# EAGLE design Breadproto (EAGLE 7.6.0)
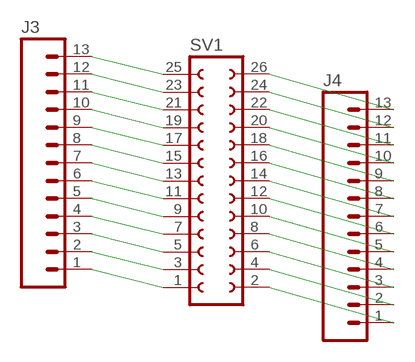
[diagram p0: schematic, sheet 1]

## Parts
J3  M13  [1X13]
J4  M13  [1X13]
SV1  FE13-2  [FE13-2]

## Nets
N$1: J3.1 SV1.1
N$2: J3.2 SV1.3
N$3: J3.3 SV1.5
N$4: J3.4 SV1.7
N$5: J3.5 SV1.9
N$6: J3.6 SV1.11
N$7: J3.7 SV1.13
N$8: J3.8 SV1.15
N$9: J3.9 SV1.17
N$10: J3.10 SV1.19
N$11: J3.11 SV1.21
N$12: J3.12 SV1.23
N$13: J3.13 SV1.25
N$14: J4.1 SV1.2
N$15: J4.2 SV1.4
N$16: J4.3 SV1.6
N$17: J4.4 SV1.8
N$18: J4.5 SV1.10
N$19: J4.6 SV1.12
N$20: J4.7 SV1.14
N$21: J4.8 SV1.16
N$22: J4.9 SV1.18
N$23: J4.10 SV1.20
N$24: J4.11 SV1.22
N$25: J4.12 SV1.24
N$26: J4.13 SV1.26

## Library data of the parts
J3 J4 = SparkFun-Connectors:M13: 13-pin single row .1" header
SV1 = con-lsta:FE13-2: FEMALE HEADER; OC_FARNELL: unknown; OC_NEWARK: unknown

## Board
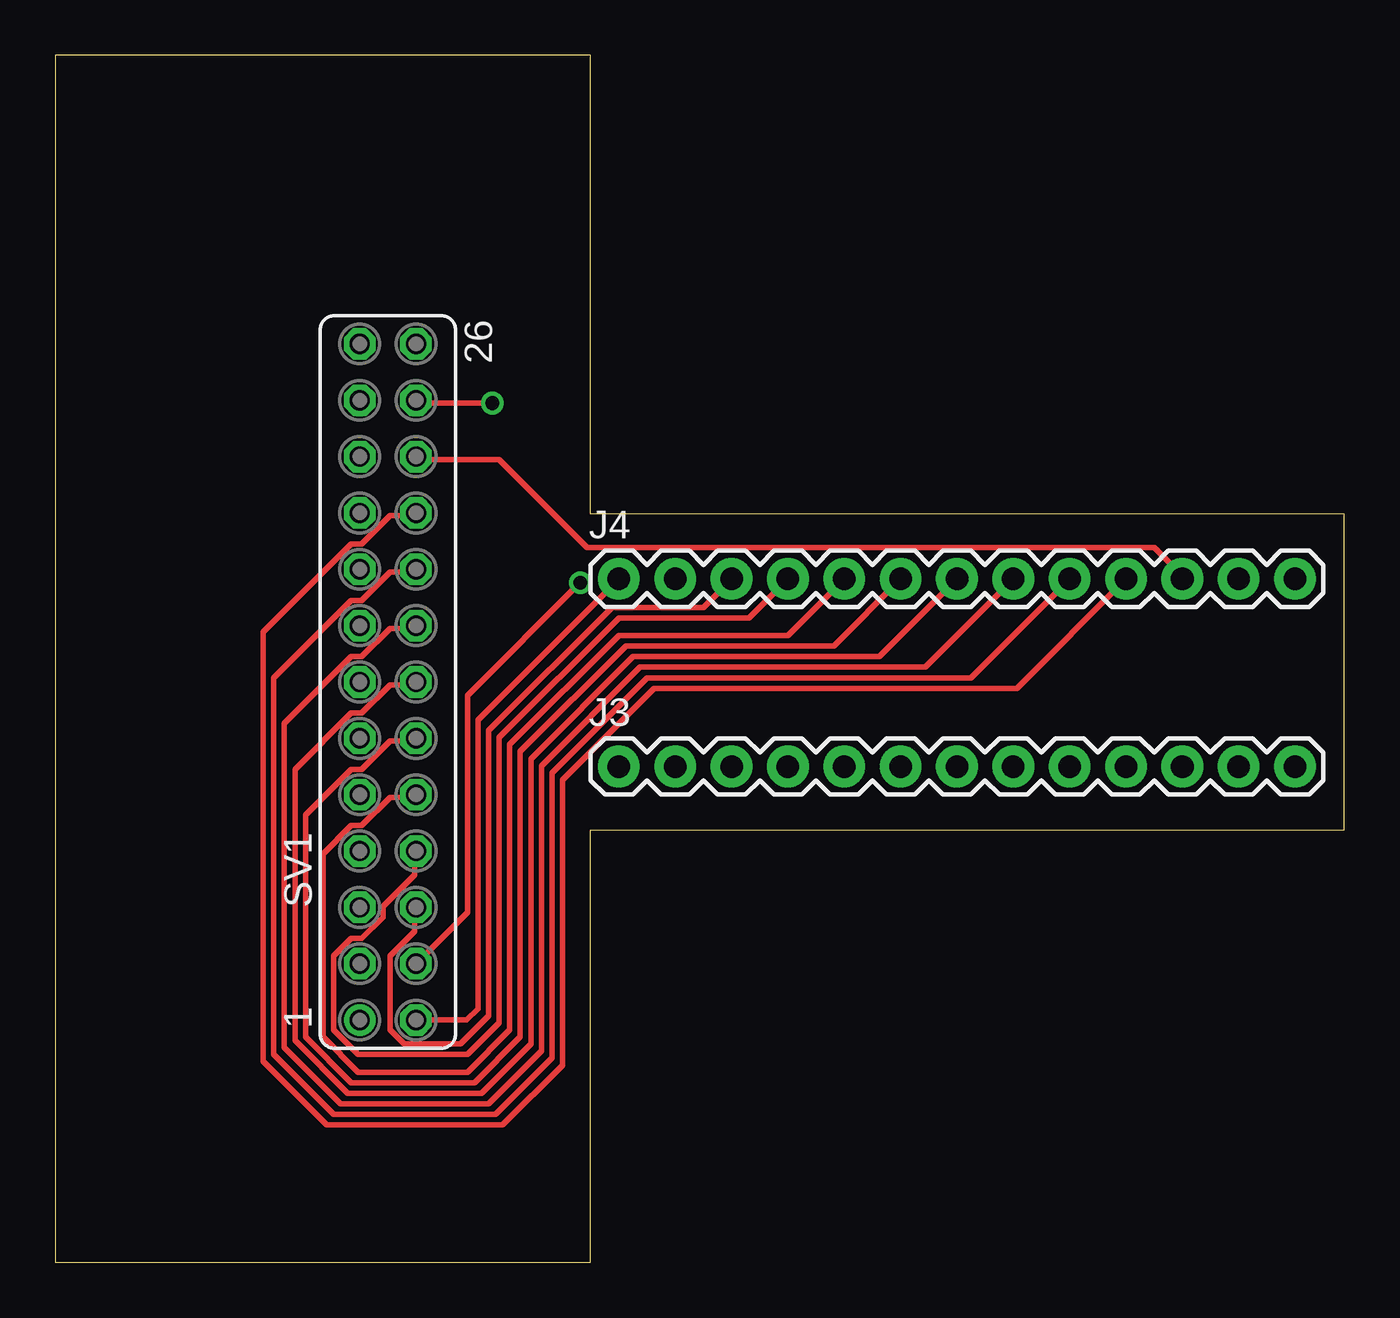
[diagram p1: board, top side]
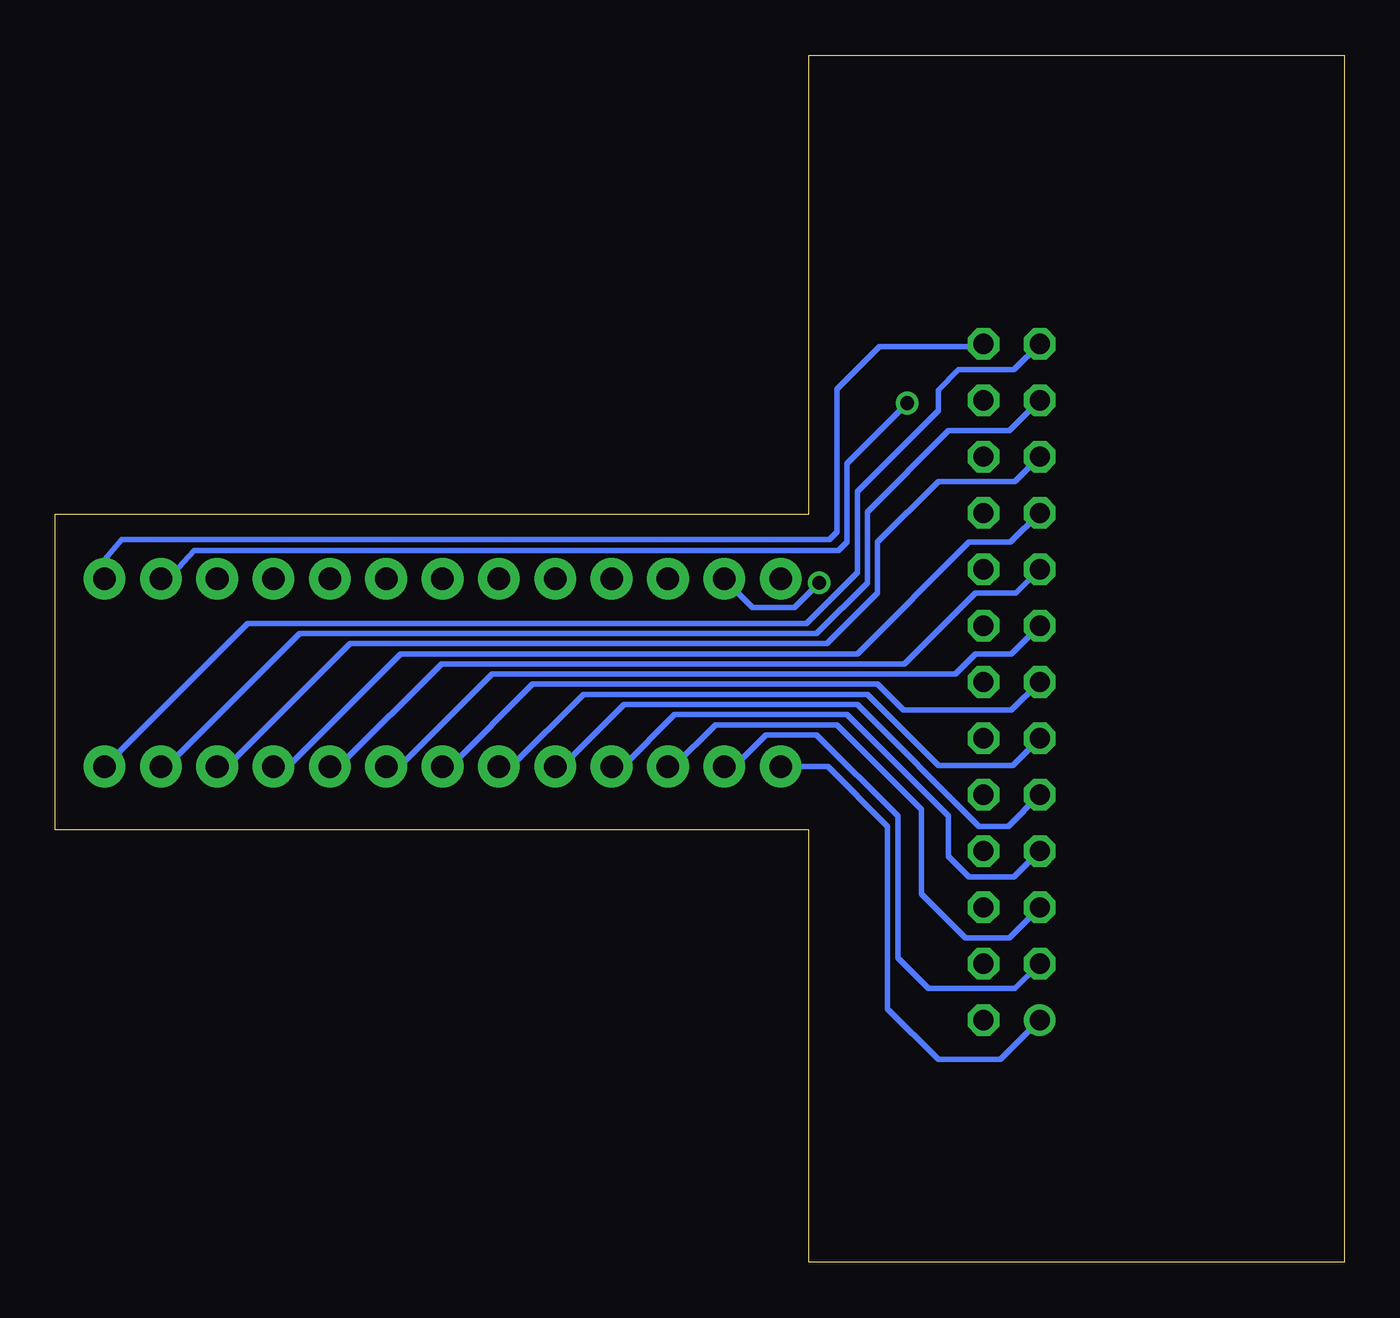
[diagram p2: board, bottom side, seen from below]

Size 58.09 x 54.41 mm. Coordinates in mm from the lower left corner, seen from the top.
Outline: 0,0 24.13,0 24.13,19.48 58.09,19.48 58.09,33.73 24.13,33.73 24.13,54.41 0,54.41 0,0
Copper layers (1*16): Top 0.035mm / dielectric 1.5mm / Bottom 0.035mm
Design rules "default": minimum track width 10mil, minimum drill 24mil, track to track 8mil, track to pad 8mil, pad to pad 8mil, via to via 8mil, smd to smd 8mil, copper to edge 40mil, drill to drill 8mil, minimum pad ring 10mil, minimum via ring 8mil, stop-mask expansion 4mil, vias tented up to drill 0mil, thermal gap 10mil

### Footprints (pad centres in the part's own frame; a part is rotated, then mirrored left to right if it is on the bottom)
1X13 = drill 1.016 pad 1.88: 1 0,0; 2 2.54,0; 3 5.08,0; 4 7.62,0; 5 10.16,0; 6 12.7,0; 7 15.24,0; 8 17.78,0; 9 20.32,0; 10 22.86,0; 11 25.4,0; 12 27.94,0; 13 30.48,0
FE13-2 = drill 0.914: 1 -15.24,1.27 | drill 0.914 octagon: 2 -15.24,-1.27; 3 -12.7,1.27; 4 -12.7,-1.27; 5 -10.16,1.27; 6 -10.16,-1.27; 7 -7.62,1.27; 8 -7.62,-1.27; 9 -5.08,1.27; 10 -5.08,-1.27; 11 -2.54,1.27; 12 -2.54,-1.27; 13 0,1.27; 14 0,-1.27; 15 2.54,1.27; 16 2.54,-1.27; 17 5.08,1.27; 18 5.08,-1.27; 19 7.62,1.27; 20 7.62,-1.27; 21 10.16,1.27; 22 10.16,-1.27; 23 12.7,1.27; 24 12.7,-1.27; 25 15.24,1.27; 26 15.24,-1.27

### Placement (x,y rotation side)
J3  25.4,22.35 0 top
J4  25.4,30.81 0 top
SV1  14.99,26.16 90 top

### Tracks (layer width: path | path; a pad name or v marks a point on that pad's centre or on a via)
N$1
  Bottom 0.254: J3.1 23.27,22.35 20.57,19.66 20.57,11.43 18.29,9.14 15.49,9.14 SV1.1
N$2
  Bottom 0.254: J3.2 27.48,22.35 26.06,23.77 23.77,23.77 20.12,20.12 20.12,13.72 18.75,12.34 14.83,12.34 SV1.3
N$3
  Bottom 0.254: J3.3 30.23,22.35 28.35,24.23 22.86,24.23 19.05,20.42 19.05,16.61 17.07,14.63 15.09,14.63 SV1.5
N$4
  Bottom 0.254: J3.4 32.51,22.35 30.18,24.69 22.4,24.69 17.83,20.12 17.83,18.29 16.92,17.37 14.88,17.37 SV1.7
N$5
  Bottom 0.254: J3.5 35.26,22.35 32.46,25.15 21.95,25.15 16.46,19.66 15.14,19.66 SV1.9
N$6
  Bottom 0.254: J3.6 37.54,22.35 34.29,25.6 21.49,25.6 18.29,22.4 14.94,22.4 SV1.11
N$7
  Bottom 0.254: J3.7 40.28,22.35 36.58,26.06 21.03,26.06 19.86,24.89 14.99,24.89 SV1.13
N$8
  Bottom 0.254: J3.8 42.57,22.35 38.41,26.52 17.53,26.52 16.61,27.43 14.99,27.43 SV1.15
N$9
  Bottom 0.254: J3.9 45.31,22.35 40.69,26.98 19.81,26.98 16.61,30.18 14.78,30.18 SV1.17
N$10
  Bottom 0.254: J3.10 47.6,22.35 42.52,27.43 21.95,27.43 16.92,32.46 15.04,32.46 SV1.19
N$11
  Bottom 0.254: J3.11 50.34,22.35 44.81,27.89 23.32,27.89 21.03,30.18 21.03,32.46 18.29,35.2 14.83,35.2 SV1.21
N$12
  Bottom 0.254: J3.12 53.09,22.35 47.09,28.35 23.77,28.35 21.49,30.63 21.49,33.83 17.83,37.49 15.09,37.49 SV1.23
N$13
  Bottom 0.254: J3.13 49.43,28.8 24.23,28.8 21.95,31.09 21.95,34.75 18.29,38.41 18.29,39.32 17.37,40.23 14.88,40.23 SV1.25
N$14
  Top 0.254: J4.1 19.05,24.46 19.05,11.43 18.54,10.92 SV1.2
N$15  (via drill 0.61)
  Top 0.254: v23.65,30.64 18.57,25.56 18.57,15.78 SV1.4
  Bottom 0.254: v23.65,30.64 24.77,29.53 26.67,29.53 27.94,30.8 J4.2
N$16
  Top 0.254: SV1.6 16.19,15.88 16.19,14.92 15.08,13.81 15.08,10.48 15.72,9.84 18.26,9.84 19.53,11.11 19.53,23.97 25.08,29.53 29.21,29.53 30.48,30.8 J4.3
N$17
  Top 0.254: SV1.8 16.19,18.41 16.19,17.46 14.76,16.03 14.76,15.56 13.81,14.61 13.34,14.61 12.54,13.81 12.54,10.48 13.65,9.37 18.57,9.37 20,10.79 20,23.65 25.4,29.05 31.27,29.05 33.02,30.8 J4.4
N$18
  Top 0.254: SV1.10 16.19,20.95 15.08,20.95 13.81,19.68 13.34,19.68 12.06,18.41 12.06,10.16 13.65,8.57 18.57,8.57 20.48,10.48 20.48,23.34 25.4,28.26 33.02,28.26 35.56,30.8 J4.5
N$19
  Top 0.254: SV1.12 16.19,23.5 15.08,23.5 13.81,22.23 13.34,22.23 11.27,20.16 11.27,10.16 13.34,8.1 18.89,8.1 20.95,10.16 20.95,23.02 25.72,27.78 35.08,27.78 38.1,30.8 J4.6
N$20
  Top 0.254: SV1.14 16.19,26.04 15.08,26.04 13.81,24.77 13.34,24.77 10.79,22.23 10.79,10 13.18,7.62 19.21,7.62 21.43,9.84 21.43,22.7 26.04,27.3 37.15,27.3 40.64,30.8 J4.7
N$21
  Top 0.254: SV1.16 16.19,28.57 15.08,28.57 13.81,27.3 13.34,27.3 10.32,24.29 10.32,9.68 12.86,7.14 19.53,7.14 21.91,9.53 21.91,22.38 26.35,26.83 39.21,26.83 43.18,30.8 J4.8
N$22
  Top 0.254: SV1.18 16.19,31.11 15.08,31.11 13.81,29.84 13.34,29.84 9.84,26.35 9.84,9.37 12.54,6.67 19.84,6.67 22.38,9.21 22.38,22.07 26.67,26.35 41.27,26.35 45.72,30.8 J4.9
N$23
  Top 0.254: SV1.20 16.19,33.66 15.08,33.66 13.81,32.38 13.34,32.38 9.37,28.42 9.37,9.05 12.22,6.19 20.16,6.19 22.86,8.89 22.86,21.75 26.99,25.88 43.34,25.88 48.26,30.8 J4.10
N$24
  Top 0.254: SV1.22 16.35,36.2 20,36.2 23.97,32.23 49.53,32.23 50.8,30.96 J4.11
N$25  (via drill 0.61)
  Top 0.254: v19.68,38.73 16.35,38.73 SV1.24
  Bottom 0.254: J4.12 53.01,30.81 51.83,32.08 22.78,32.08 22.4,32.46 22.4,36.02 v19.68,38.73
N$26
  Bottom 0.254: J4.13 55.88,31.69 55.09,32.59 23.19,32.59 22.86,32.92 22.86,39.37 20.95,41.27 16.35,41.27 SV1.26

### Text on the board
200bmp: 1 | 1 | 1 | 1 | 1 | 1 | 1 | 1 | 1 | 1 | 1 | 1 | 1 | 1 | 1 | 1 | 1 | 1 | 1 | 1 | 1 | 1 | 1 | 1 | 1 | 1 | 1 | 1 | 1 | .com | /Users/hunter/Desktop/Conformité_Européenne_(logo).bmp